# EAGLE design Team_14_03 (EAGLE 8.4.0)
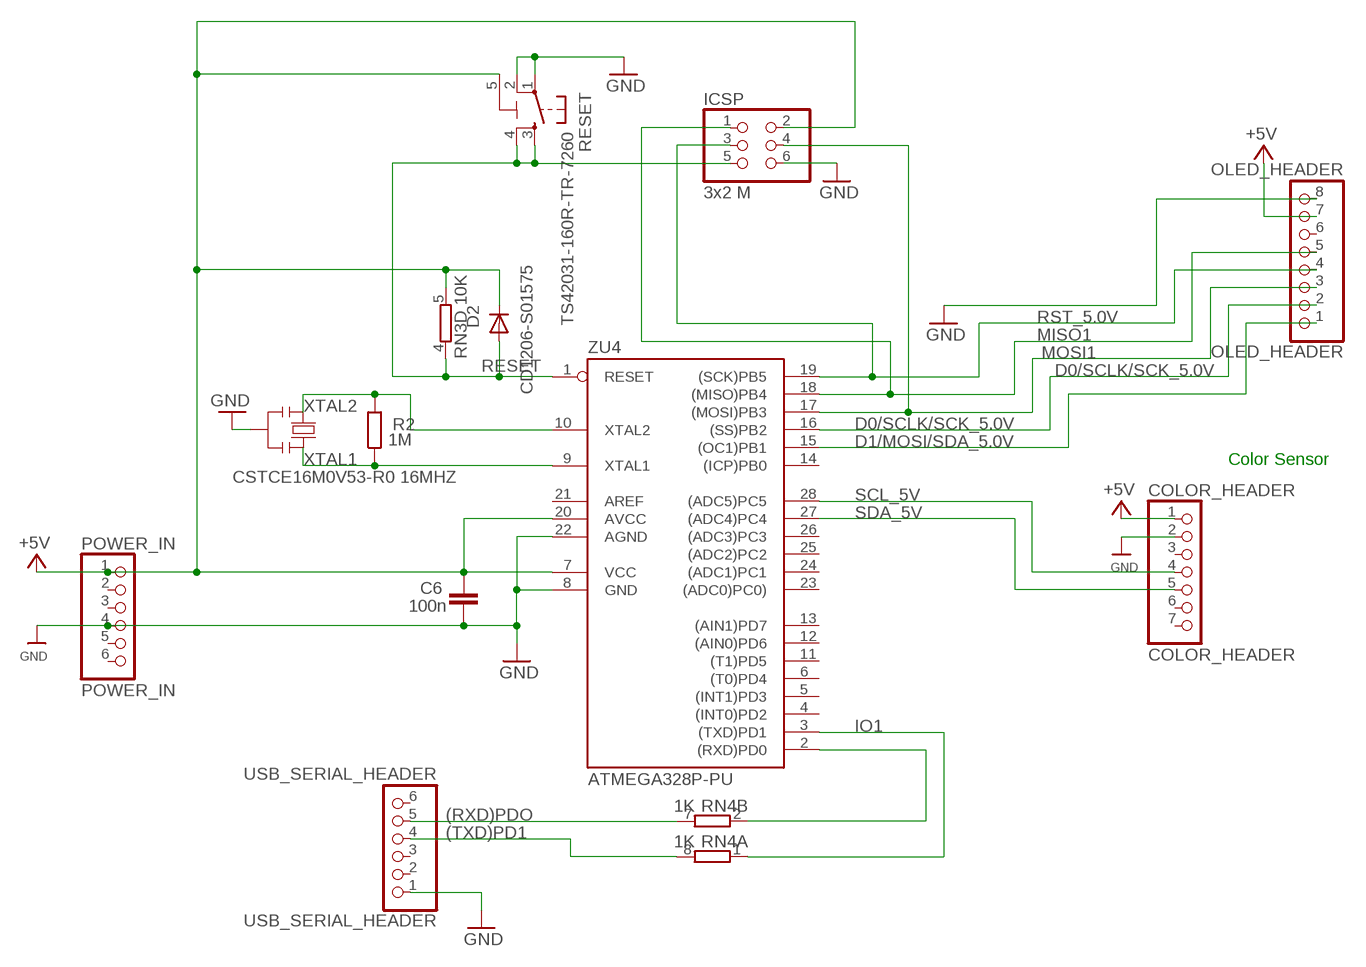
[diagram p0: schematic, sheet 1]

## Parts
C6  100n  C-EU0603-RND  [C0603-ROUND]
COLOR_HEADER  COLOR_HEADER  HEADER-1X770MIL  [1X07_ROUND_70]
D2  CD1206-S01575  DIODE-MINIMELF  [MINIMELF]
ICSP  3x2 M  PINHD-2X3  [2X03]
OLED_HEADER  OLED_HEADER  HEADER-1X870MIL  [1X08_ROUND_70]
POWER_IN  POWER_IN  PINHD-1X6  [1X06]
R2  1M  R-EU_R0603  [R0603-ROUND]
RESET  TS42031-160R-TR-7260  TS42  [TS42]
RN3  10K  4R-NCAY16  [CAY16]
RN4  1K  4R-NCAY16  [CAY16]
USB_SERIAL_HEADER  USB_SERIAL_HEADER  PINHD-1X6  [1X06]
Y2  CSTCE16M0V53-R0 16MHZ  RESONATORMU  [RESONATOR]
ZU4  ATMEGA328P-PU  [DIL28-3]

## Nets
(RXD)PDO: RN4.7 USB_SERIAL_HEADER.5
(TXD)PD1: RN4.8 USB_SERIAL_HEADER.4
+5V [usbvcc]: C6.2 COLOR_HEADER.1 D2.C ICSP.2 OLED_HEADER.7 POWER_IN.1 RESET.5(5-GND) RN3.5 ZU4.7(VCC) ZU4.20(AVCC)
D0/SCLK/SCK_5.0V: OLED_HEADER.2 ZU4.16((SS)PB2)
D1/MOSI/SDA_5.0V: OLED_HEADER.1 ZU4.15((OC1)PB1)
GND [gnd]: C6.1 COLOR_HEADER.2 ICSP.6 OLED_HEADER.8 POWER_IN.4 RESET.1 RESET.2 USB_SERIAL_HEADER.1 Y2.2 ZU4.8(GND) ZU4.22(AGND)
IO1: RN4.1 ZU4.3((TXD)PD1)
IO11: RN4.2 ZU4.2((RXD)PD0)
MISO1: ICSP.1 OLED_HEADER.5 ZU4.18((MISO)PB4)
MOSI1: ICSP.4 OLED_HEADER.3 ZU4.17((MOSI)PB3)
RESET: D2.A ICSP.5 RESET.3 RESET.4 RN3.4 ZU4.1(RESET)
RST_5.0V: ICSP.3 OLED_HEADER.4 ZU4.19((SCK)PB5)
SCL_5V: COLOR_HEADER.4 ZU4.28((ADC5)PC5)
SDA_5V: COLOR_HEADER.5 ZU4.27((ADC4)PC4)
XTAL1: R2.1 Y2.3 ZU4.9(XTAL1)
XTAL2: R2.2 Y2.1 ZU4.10(XTAL2)
Unconnected: COLOR_HEADER.3 COLOR_HEADER.6 COLOR_HEADER.7 OLED_HEADER.6 POWER_IN.2 POWER_IN.3 POWER_IN.5 POWER_IN.6 RN3.1 RN3.2 RN3.3 RN3.6 RN3.7 RN3.8 RN4.3 RN4.4 RN4.5 RN4.6 USB_SERIAL_HEADER.2 USB_SERIAL_HEADER.3 USB_SERIAL_HEADER.6 ZU4.4((INT0)PD2) ZU4.5((INT1)PD3) ZU4.6((T0)PD4) ZU4.11((T1)PD5) ZU4.12((AIN0)PD6) ZU4.13((AIN1)PD7) ZU4.14((ICP)PB0) ZU4.21(AREF) ZU4.23((ADC0)PC0)) ZU4.24((ADC1)PC1) ZU4.25((ADC2)PC2) ZU4.26((ADC3)PC3)

## Notes on the sheet
- Color Sensor

## Library data of the parts
C6 = SmartPrj:C-EU: CAPACITOR, European symbol
COLOR_HEADER = microbuilder:HEADER-1X7: PIN HEADER
D2 = diode:DIODE-: DIODE
ICSP = SmartPrj:PINHD-2X3: PIN HEADER
OLED_HEADER = microbuilder:HEADER-1X8: PIN HEADER
POWER_IN USB_SERIAL_HEADER = adafruit:PINHD-1X6: PIN HEADER
R2 = SmartPrj:R-EU_: RESISTOR, European symbol
RESET = SmartPrj:TS42: TS42 Dongnan Electronics Tact switch VDC 12V - 50mA
RN3 RN4 = resistor-dil:4R-N: Array Chip Resistor Source: RS Component / Phycomp
Y2 = SmartPrj:RESONATOR
ZU4 = SmartPrj:ATMEGA328P-: MICROCONTROLLER 4 Kbytes FLASH 128 bytes SRAM 256 bytes EEPROM UART 6-channel 10 bit ADC

## Net classes
1 power: width 0.61 mm, drill 0.61 mm, clearance 0.254 mm
2 gnd: width 0.305 mm, drill 0.559 mm, clearance 0.254 mm
3 usbvcc: width 0.508 mm, drill 0.61 mm, clearance 0.254 mm
4 aref: width 0.406 mm, drill 0.61 mm, clearance 0.254 mm

## Board
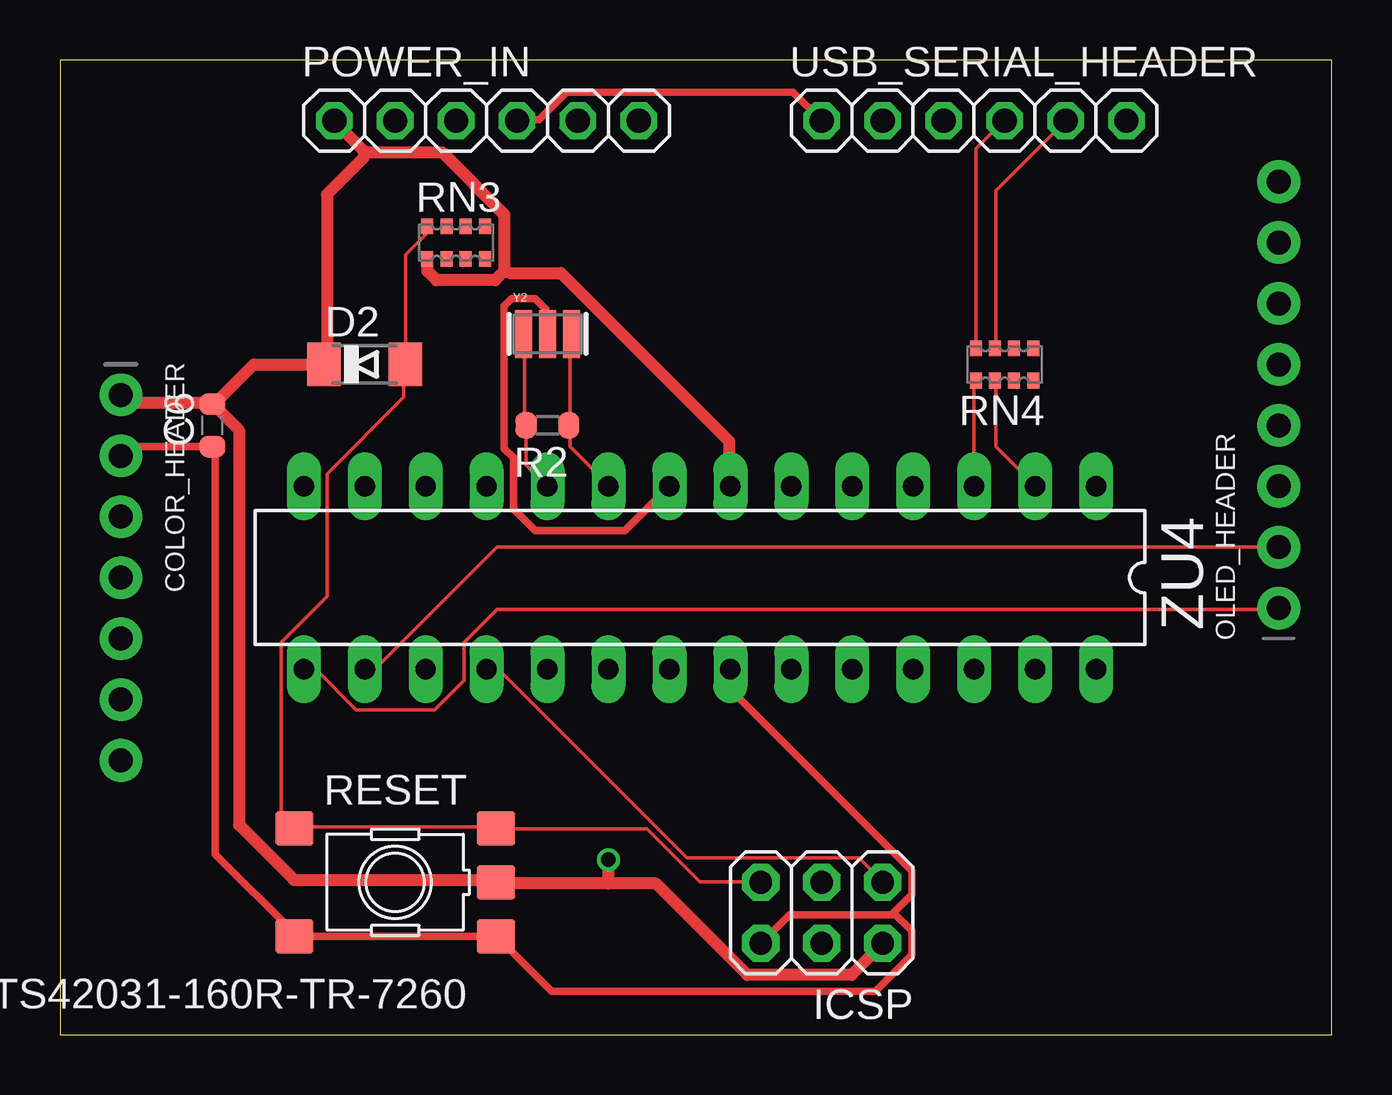
[diagram p1: board, top side]
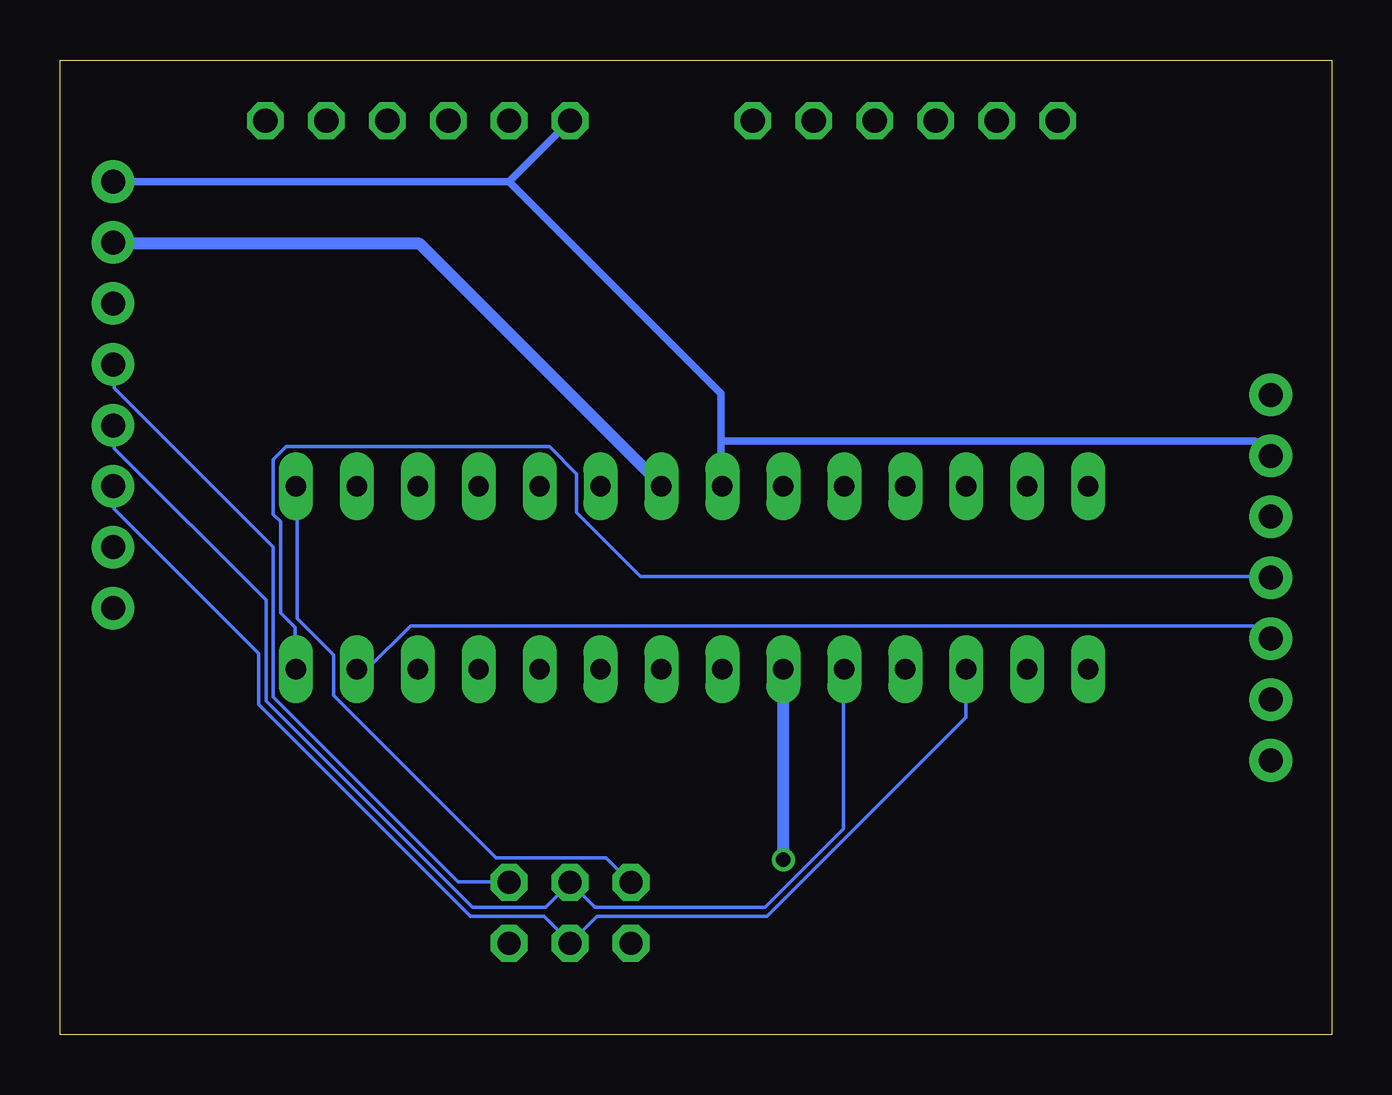
[diagram p2: board, bottom side, seen from below]

Size 53.01 x 40.63 mm. Coordinates in mm from the lower left corner, seen from the top.
Outline: 0,0 53.01,0 53.01,40.63 0,40.63 0,0
Copper layers (1*16): Top 0.0356mm / dielectric 1.5011mm / Bottom 0.0356mm
Design rules "oshpark-2layer": minimum track width 6mil, minimum drill 13mil, track to track 6mil, track to pad 6mil, pad to pad 6mil, via to via 6mil, smd to smd 6mil, copper to edge 15mil, drill to drill 6mil, minimum pad ring 7mil, minimum via ring 7mil, stop-mask expansion 2.5mil, vias tented up to drill 0mil, thermal gap 10mil

### Footprints (pad centres in the part's own frame; a part is rotated, then mirrored left to right if it is on the bottom)
C0603-ROUND = smd 0.898 x 1.1: 1 -0.889,0; 2 0.889,0
1X07_ROUND_70 = drill 1 pad 1.778: 1 -7.62,0; 2 -5.08,0; 3 -2.54,0; 4 0,0; 5 2.54,0; 6 5.08,0; 7 7.62,0
MINIMELF = smd 1.4 x 1.8: A 1.7,0; C -1.7,0
2X03 = drill 0.95 pad 1.55 octagon: 1 -2.54,-1.27; 2 -2.54,1.27; 3 0,-1.27; 4 0,1.27; 5 2.54,-1.27; 6 2.54,1.27
1X08_ROUND_70 = drill 1 pad 1.778: 1 -8.89,0; 2 -6.35,0; 3 -3.81,0; 4 -1.27,0; 5 1.27,0; 6 3.81,0; 7 6.35,0; 8 8.89,0
1X06 = drill 1.016 octagon: 1 -6.35,0; 2 -3.81,0; 3 -1.27,0; 4 1.27,0; 5 3.81,0; 6 6.35,0
R0603-ROUND = smd 0.898 x 1.1: 1 -0.889,0; 2 0.889,0
TS42 = smd 1.6 x 1.4: 1 -4.2,2.25; 2 4.2,2.25; 3 -4.2,-2.25; 4 4.2,-2.25; 5 -4.2,0
CAY16 = smd 0.5 x 0.65: 1 -1.2,-0.675; 2 -0.4,-0.675; 3 0.4,-0.675; 4 1.2,-0.675; 5 1.2,0.675; 6 0.4,0.675; 7 -0.4,0.675; 8 -1.2,0.675
RESONATOR = smd 0.7 x 2: 1 -1,0; 2 0,0; 3 1,0
DIL28-3 = drill 0.85 pad 1.422 long: 1 -16.51,-3.81; 2 -13.97,-3.81; 3 -11.43,-3.81; 4 -8.89,-3.81; 5 -6.35,-3.81; 6 -3.81,-3.81; 7 -1.27,-3.81; 8 1.27,-3.81; 9 3.81,-3.81; 10 6.35,-3.81; 11 8.89,-3.81; 12 11.43,-3.81; 13 13.97,-3.81; 14 16.51,-3.81; 15 16.51,3.81; 16 13.97,3.81; 17 11.43,3.81; 18 8.89,3.81; 19 6.35,3.81; 20 3.81,3.81; 21 1.27,3.81; 22 -1.27,3.81; 23 -3.81,3.81; 24 -6.35,3.81; 25 -8.89,3.81; 26 -11.43,3.81; 27 -13.97,3.81; 28 -16.51,3.81

### Placement (x,y rotation side)
C6  6.35,25.4 90 top
COLOR_HEADER  2.54,19.05 270 top
D2  12.7,27.94 0 top
ICSP  31.75,5.08 180 top
OLED_HEADER  50.8,26.67 90 top
POWER_IN  17.78,38.1 0 top
R2  20.32,25.4 180 top
RESET  13.97,6.35 180 top
RN3  16.51,33.02 180 top
RN4  39.37,27.94 0 top
USB_SERIAL_HEADER  38.1,38.1 0 top
Y2  20.32,29.21 0 top
ZU4  26.67,19.05 180 top

### Tracks (layer width: path | path; a pad name or v marks a point on that pad's centre or on a via)
(RXD)PDO
  Top 0.152: RN4.7 39.01,28.63 39.01,35.18 41.91,38.08 USB_SERIAL_HEADER.5
(TXD)PD1
  Top 0.152: RN4.8 38.18,36.93 39.32,38.08 USB_SERIAL_HEADER.4
+5V  (via drill 0.61)
  Top 0.508: 22.86,6.3 24.84,6.3 28.65,2.49 32.99,2.49 34.29,3.79 ICSP.2 | 22.86,6.3 18.21,6.3 RESET.5 17.98,6.45 9.75,6.45 7.47,8.74 7.47,25.2 6.55,26.11 C6.2 | 22.86,6.3 v22.86,7.29 | C6.2 6.33,26.34 2.9,26.34 2.59,26.64 COLOR_HEADER.1 | C6.2 6.55,26.42 8.08,27.94 D2.C 11.12,28.17 11.12,35.03 12.65,36.55 12.72,36.78 | 18.52,31.83 18.14,31.45 15.7,31.45 15.32,31.83 15.32,32.28 RN3.5 | 18.52,31.83 18.52,34.19 15.93,36.78 12.72,36.78 | 12.72,36.78 11.43,38.08 POWER_IN.1 | ZU4.7 27.89,22.91 27.89,24.74 20.88,31.75 18.75,31.75 18.52,31.83
  Bottom 0.508: v22.86,7.29 ZU4.20 | OLED_HEADER.7 50.75,32.97 38.02,32.97 27.96,22.91 ZU4.7
D0/SCLK/SCK_5.0V
  Top 0.152: OLED_HEADER.2 18.21,20.32 13.18,15.29 12.72,15.29 ZU4.16
D1/MOSI/SDA_5.0V
  Top 0.152: ZU4.15 10.21,15.21 10.67,15.21 12.34,13.54 15.62,13.54 16.84,14.76 16.84,16.36 18.21,17.73 50.75,17.73 OLED_HEADER.1
GND
  Top 0.305: ZU4.8 23.55,21.01 19.81,21.01 18.9,21.92 18.9,24.05 18.52,24.43 18.52,30.38 18.82,30.68 19.81,30.68 20.27,30.23 20.27,29.23 Y2.2 | USB_SERIAL_HEADER.1 30.56,39.29 21.11,39.29 19.96,38.15 19.05,38.15 POWER_IN.4 | 34.75,5.08 34.67,5 30.4,5 ICSP.6 | 34.75,5.08 35.51,5.84 35.51,6.83 27.96,14.38 27.96,15.21 ZU4.22 | COLOR_HEADER.2 2.59,24.13 2.97,24.51 C6.1 6.48,24.43 6.48,7.52 9.75,4.24 RESET.2 9.83,4.09 18.14,4.09 RESET.1 18.29,4.01 20.5,1.8 33.98,1.8 35.51,3.33 35.51,4.32 34.75,5.08
  Bottom 0.305: 34.29,35.56 OLED_HEADER.8 | USB_SERIAL_HEADER.1 34.29,35.56 | 25.45,24.74 25.45,26.72 34.29,35.56 | 25.45,24.74 25.45,22.91 ZU4.8 | 25.45,24.74 3.2,24.74 2.59,24.13 COLOR_HEADER.2
IO1
  Top 0.152: ZU4.3 38.1,27.25 RN4.1
IO11
  Top 0.152: RN4.2 39.01,27.25 39.01,24.51 40.62,22.91 ZU4.2
MISO1
  Top 0.152: ZU4.18 17.83,15.21 18.29,15.21 26.14,7.37 33.3,7.37 34.29,6.38 ICSP.1
  Bottom 0.152: OLED_HEADER.5 50.75,27.94 50.75,26.95 44.12,20.32 44.12,14.07 36.42,6.38 34.29,6.38 ICSP.1
MOSI1
  Bottom 0.152: ZU4.17 15.24,13.23 23.55,4.93 30.63,4.93 ICSP.4 31.77,3.86 32.84,4.93 35.89,4.93 44.73,13.77 44.73,15.9 50.75,21.92 50.75,22.84 OLED_HEADER.3
RESET
  Top 0.152: RN3.4 15.24,33.66 15.24,33.35 14.4,32.51 D2.A 14.33,27.94 14.33,26.57 11.12,23.37 11.12,18.26 9.22,16.36 9.22,9.35 9.83,8.74 RESET.4 9.83,8.66 18.14,8.66 RESET.3 18.21,8.59 24.46,8.59 26.67,6.38 29.18,6.38 ICSP.5
  Bottom 0.152: ZU4.1 43.13,22.84 43.13,17.35 41.6,15.82 41.6,14.15 34.82,7.37 30.25,7.37 29.26,6.38 ICSP.5
RST_5.0V
  Bottom 0.152: ZU4.19 20.34,15.21 20.34,8.59 23.62,5.31 30.71,5.31 ICSP.3 31.77,6.3 32.77,5.31 35.81,5.31 44.42,13.92 44.42,18.11 50.75,24.43 50.75,25.35 OLED_HEADER.4
SCL_5V
  Bottom 0.152: ZU4.28 43.2,15.29 43.2,16.97 43.81,17.58 43.81,21.39 44.12,21.69 44.12,23.98 43.59,24.51 32.61,24.51 31.47,23.37 31.47,21.77 28.8,19.1 2.59,19.1 COLOR_HEADER.4
SDA_5V
  Bottom 0.152: ZU4.27 40.62,15.29 40.16,15.29 38.41,17.04 3.12,17.04 2.59,16.51 COLOR_HEADER.5
XTAL1
  Top 0.152: ZU4.9 22.86,22.91 21.26,24.51 21.26,25.35 R2.1 21.26,25.43 21.26,29.16 Y2.3
XTAL2
  Top 0.152: ZU4.10 19.43,23.75 R2.2 19.43,25.43 19.36,25.5 19.36,29.16 Y2.1